# EAGLE design esp3d_8266_r2 (EAGLE 7.7.0)
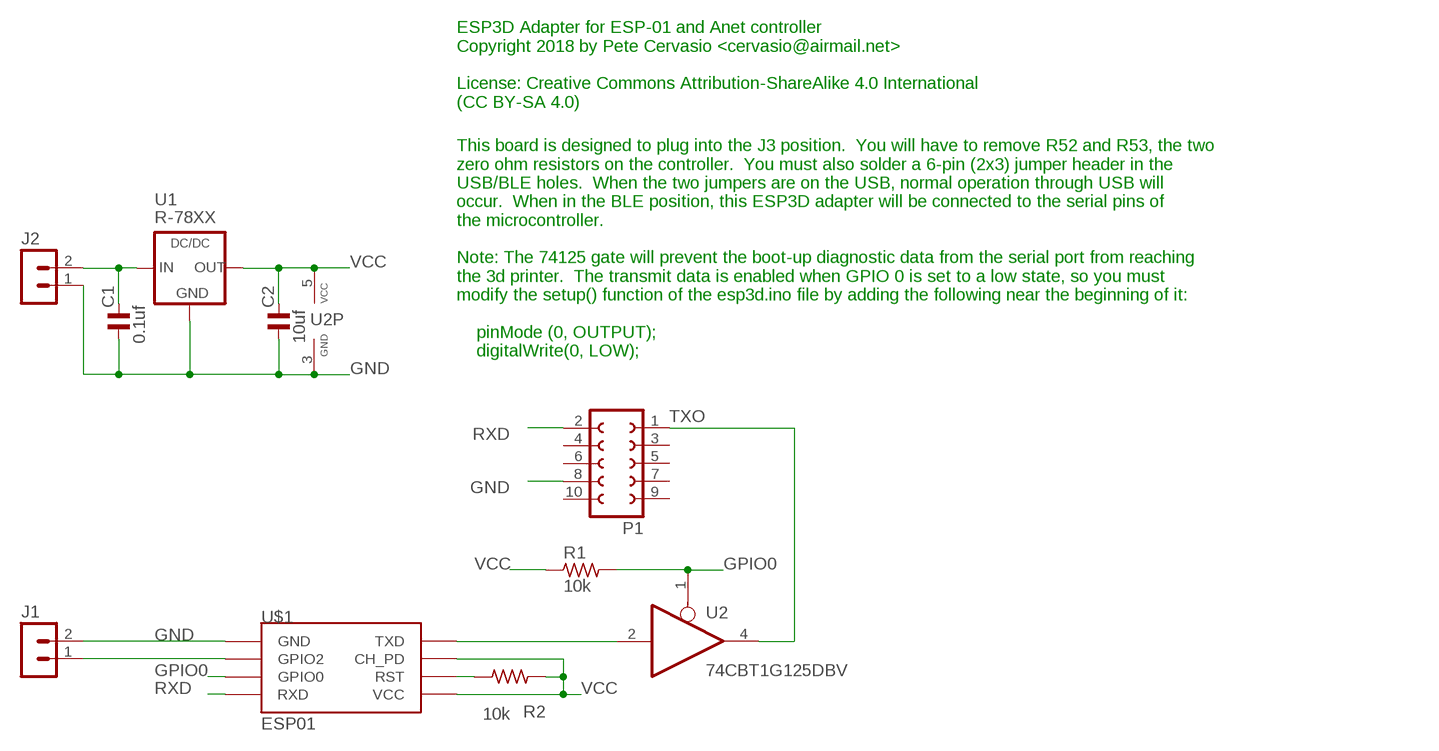
[diagram p0: schematic, sheet 1]

## Parts
C1  0.1uf  C_0805  [C0805]
C2  10uf  C_0805  [C0805]
J1  MA02-1  [MA02-1]
J2  MA02-1  [MA02-1]
P1  FE05-2  [FE05-2]
R1  10k  R_0805  [R0805]
R2  10k  R_0805  [R0805]
U1  R-78XX  [R-78XX]
U2  74CBT1G125DBV  [SOT23-5]
U$1  ESP01  [ESP01]

## Nets
GND: C1.1 C2.1 J1.2 J2.1 P1.8 U1.2(GND) U2.3(GND) U$1.GND
GPIO0: R1.2 U2.1(OE) U$1.GPIO0
N$1: U2.2(I) U$1.TX(TXD)
N$2: R2.2 U$1.RST
N$3: J1.1 U$1.GPIO2
N$6: C1.2 J2.2 U1.1(IN)
RXD: P1.2 U$1.RX(RXD)
TXO: P1.1 U2.4(O)
VCC: C2.2 R1.1 R2.1 U1.3(OUT) U2.5(VCC) U$1.CH_PD U$1.VCC
Unconnected: P1.3 P1.4 P1.5 P1.6 P1.7 P1.9 P1.10

## Notes on the sheet
- ESP3D Adapter for ESP-01 and Anet controller
  Copyright 2018 by Pete Cervasio <cervasio@airmail.net>
  
  License: Creative Commons Attribution-ShareAlike 4.0 International 
  (CC BY-SA 4.0)
- This board is designed to plug into the J3 position.  You will have to remove R52 and R53, the two
  zero ohm resistors on the controller.  You must also solder a 6-pin (2x3) jumper header in the
  USB/BLE holes.  When the two jumpers are on the USB, normal operation through USB will
  occur.  When in the BLE position, this ESP3D adapter will be connected to the serial pins of
  the microcontroller.
  
  Note: The 74125 gate will prevent the boot-up diagnostic data from the serial port from reaching
  the 3d printer.  The transmit data is enabled when GPIO 0 is set to a low state, so you must
  modify the setup() function of the esp3d.ino file by adding the following near the beginning of it:
  
      pinMode (0, OUTPUT);
      digitalWrite(0, LOW);

## Library data of the parts
C1 C2 = rc-master-smd:C_: NON-POLARIZED CAP
J1 J2 = con-lstb:MA02-1: PIN HEADER
P1 = con-lsta:FE05-2: FEMALE HEADER
R1 R2 = rc-master-smd:R_: RESISTOR
U1 = dc-dc-converter:R-78XX: DC-DC CONVERTER R-78xx-0.5 Series RECOM International
U2 = 74xx-little-us:74*1G125: Single Bus Buffer Gate with 3-State Output
U$1 = esp8266modules:ESP01: ESP8266 Wifi module 01

## Board
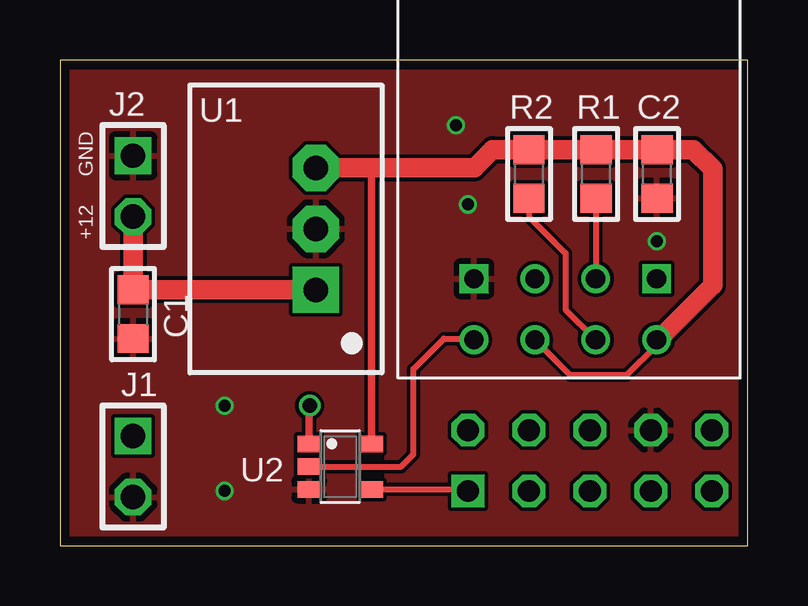
[diagram p1: board, top side]
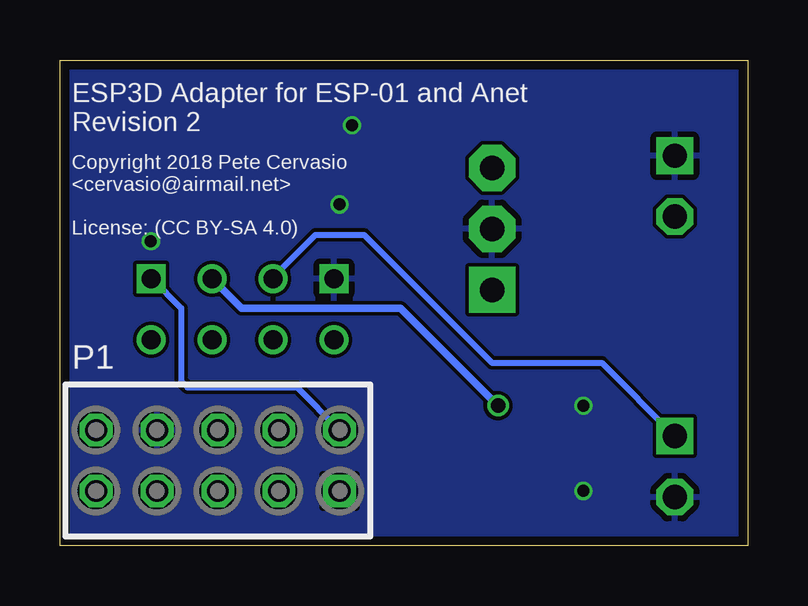
[diagram p2: board, bottom side, seen from below]

Size 28.68 x 20.24 mm. Coordinates in mm from the lower left corner, seen from the top.
Outline: 0,0 28.68,0 28.68,20.24 0,20.24 0,0
Copper layers (1*16): Top 0.035559375mm / dielectric 1.6mm / Bottom 0.035559375mm
Design rules "oshpark-2layer": minimum track width 6mil, minimum drill 10mil, track to track 6mil, track to pad 6mil, pad to pad 6mil, via to via 6mil, smd to smd 6mil, copper to edge 15mil, drill to drill 6mil, minimum pad ring 5mil, minimum via ring 5mil, stop-mask expansion 2.5mil, vias tented up to drill 0mil, thermal gap 10mil

### Footprints (pad centres in the part's own frame; a part is rotated, then mirrored left to right if it is on the bottom)
C0805 = smd 1.2 x 1.3: 1 -1.016,0; 2 1.016,0
MA02-1 = drill 1.016 square: 1 -1.27,0 | drill 1.016 octagon: 2 1.27,0
FE05-2 = drill 0.914 square: 1 -5.08,1.27 | drill 0.914 octagon: 2 -5.08,-1.27; 3 -2.54,1.27; 4 -2.54,-1.27; 5 0,1.27; 6 0,-1.27; 7 2.54,1.27; 8 2.54,-1.27; 9 5.08,1.27; 10 5.08,-1.27
R0805 = smd 1.2 x 1.3: 1 -1.016,0; 2 1.016,0
R-78XX = drill 1.016 pad 1.93 square: 1 -2.54,0 | drill 1.016 pad 1.93 octagon: 2 0,0; 3 2.54,0
SOT23-5 = smd 0.69 x 0.99: 1 -0.95,-1.29; 2 0,-1.29; 3 0.95,-1.29; 4 0.95,1.3; 5 -0.95,1.3
ESP01 = drill 0.8: CH_PD -1.285,-8.178; GPIO0 1.255,-5.638; GPIO2 -1.285,-5.638; RST 1.255,-8.178; TX -3.825,-8.178; VCC 3.795,-8.178 | drill 0.8 square: GND -3.825,-5.638; RX 3.795,-5.638

### Placement (x,y rotation side)
C1  3.05,9.65 90 top
C2  24.89,15.49 90 top
J1  3.05,3.3 270 top
J2  3.05,14.99 270 top
P1  22.1,3.56 180 bottom
R1  22.35,15.49 270 top
R2  19.56,15.49 270 top
U1  10.67,13.21 90 top
U2  11.68,3.3 270 top
U$1  21.08,16.76 0 top

### Tracks (layer width: path | path; a pad name or v marks a point on that pad's centre or on a via)
GND  (via drill 0.5 pad 0.33)
  other vias: 24.89,12.7 6.86,2.29 6.86,5.84 17.02,14.22 16.51,17.53
  pour Bottom: 0,20.07 29.46,20.07 29.46,0 0,0
  pour Top: 0,20.07 29.46,20.07 29.46,0 0,0
GPIO0  (via drill 0.6 pad 0.33)
  Top 0.254: R1.2 22.35,11.65 U$1.GPIO0
  Top 0.305: U2.1 10.39,5.82 v10.41,5.84
  Bottom 0.305: v10.41,5.84 14.48,9.91 21.12,9.91 U$1.GPIO0
N$1
  Top 0.254: U2.2 14.22,3.3 14.73,3.81 14.73,7.37 16,8.64 17.21,8.64 U$1.TX
N$2
  Top 0.254: R2.2 19.56,13.72 21.08,12.19 21.08,9.84 U$1.RST
N$3
  Bottom 0.254: U$1.GPIO2 19.8,11.19 18.03,12.95 16,12.95 10.67,7.62 6.1,7.62 J1.1
N$6
  Top 0.813: J2.2 C1.2 U1.1
RXD
  Bottom 0.254: U$1.RX 24.84,11.13 23.62,9.91 23.62,6.86 23.37,6.6 18.8,6.6 P1.2
TXO
  Top 0.254: U2.4 16.95,2.35 P1.1
VCC
  Top 0.254: U$1.VCC 24.88,8.37 23.62,7.11 21.27,7.11 U$1.CH_PD
  Top 0.305: U2.5 12.98,15.72 12.95,15.75
  Top 0.813: U1.3 12.95,15.75 17.27,15.75 18.03,16.51 R2.1 R1.1 C2.2 26.42,16.51 27.21,15.72 27.21,10.85 25.2,8.84 U$1.VCC

### Text on the board
tNames: GND | +12
bNames: ESP3D Adapter for ESP-01 and Anet / Revision 2 | Copyright 2018 Pete Cervasio / <cervasio@airmail.net> / / License: (CC BY-SA 4.0)